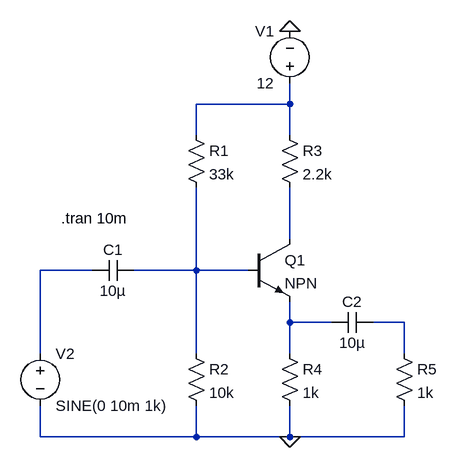
[diagram p0: schematic 5-cc.asc]
5-cc.asc, the LTspice schematic file:
Version 4.1
SHEET 1 880 680
WIRE 288 -96 288 -128
WIRE 288 -96 144 -96
WIRE 144 -48 144 -96
WIRE 288 -48 288 -96
WIRE 288 112 288 32
WIRE -16 160 -96 160
WIRE 144 160 144 32
WIRE 144 160 48 160
WIRE 224 160 144 160
WIRE 288 240 288 208
WIRE 352 240 288 240
WIRE 464 240 416 240
WIRE -96 288 -96 160
WIRE 144 288 144 160
WIRE 288 288 288 240
WIRE 464 288 464 240
WIRE -96 416 -96 368
WIRE 144 416 144 368
WIRE 144 416 -96 416
WIRE 288 416 288 368
WIRE 288 416 144 416
WIRE 464 416 464 368
WIRE 464 416 288 416
FLAG 288 -208 0
FLAG 288 416 0
SYMBOL npn 224 112 R0
SYMATTR InstName Q1
SYMBOL voltage 288 -112 R180
WINDOW 0 24 96 Left 2
WINDOW 3 24 16 Left 2
SYMATTR InstName V1
SYMATTR Value 12
SYMBOL res 128 -64 R0
SYMATTR InstName R1
SYMATTR Value 33k
SYMBOL res 128 272 R0
SYMATTR InstName R2
SYMATTR Value 10k
SYMBOL res 272 -64 R0
SYMATTR InstName R3
SYMATTR Value 2.2k
SYMBOL res 272 272 R0
SYMATTR InstName R4
SYMATTR Value 1k
SYMBOL res 448 272 R0
SYMATTR InstName R5
SYMATTR Value 1k
SYMBOL voltage -96 272 R0
WINDOW 123 0 0 Left 0
WINDOW 39 0 0 Left 0
SYMATTR InstName V2
SYMATTR Value SINE(0 10m 1k)
SYMBOL cap 48 144 R90
WINDOW 0 0 32 VBottom 2
WINDOW 3 32 32 VTop 2
SYMATTR InstName C1
SYMATTR Value 10µ
SYMBOL cap 416 224 R90
WINDOW 0 0 32 VBottom 2
WINDOW 3 32 32 VTop 2
SYMATTR InstName C2
SYMATTR Value 10µ
TEXT -64 80 Left 2 !.tran 10m

The netlist it stands for:
* 5-cc.asc
Q1 N002 N004 N005 0 NPN
V1 N001 0 12
R1 N001 N004 33k
R2 N004 0 10k
R3 N001 N002 2.2k
R4 N005 0 1k
R5 N006 0 1k
V2 N003 0 SINE(0 10m 1k)
C1 N004 N003 10µ
C2 N006 N005 10µ
.model NPN NPN
.model PNP PNP
.lib standard.bjt
.tran 10m
.backanno
.end